# Altium schematic sheet Switch for MMU Schematic.schdoc
size 119 x 44 mm
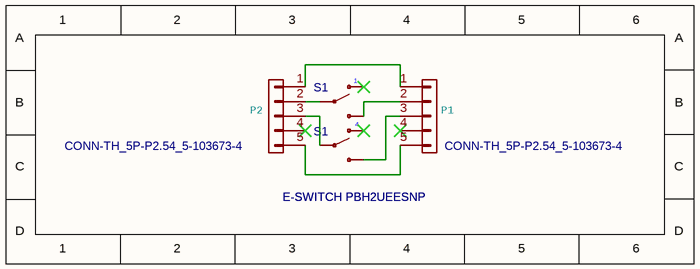
[diagram p0: Switch for MMU Schematic.schdoc]

## Parts
(Parts that share a designator on the sheet are numbered #1, #2 ... from top to bottom, then left to right.)
P1  MOLEX 70543-0004  [CONN-TH_5P-P2.54_5-103673-4]  (value not drawn)
P2  MOLEX 70543-0004  [CONN-TH_5P-P2.54_5-103673-4]  (value not drawn)
S1#1  SWITCH-SPSTPTH2  [E-SWITCH PBH2UEESNP]  (value not drawn)
S1#2  SWITCH-SPSTPTH2  [E-SWITCH PBH2UEESNP]  (value not drawn)

## Nets
NetP1_1: P1.1(P1) P2.1(P1)
NetP1_2: P1.2(P2) S1#1.1(S)
NetP1_3: P1.3(P3) S1#2.4(S)
NetP1_5: P1.5(P5) P2.5(P5)
NetP2_2: P2.2(P2) S1#1.2(P)
NetP2_3: P2.3(P3) S1#2.5(P)

Not connected (* = marked no-connect by the designer): P1 4(P4)*; P2 4(P4)*; S1#1 3(O)*; S1#2 6(O)*

## Notes on the sheet
- (in symbol MOLEX 70543-0004) CONN-TH_5P-P2.54_5-103673-4
- (in symbol SWITCH-SPSTPTH2) E-SWITCH PBH2UEESNP

## Library data of the parts
P1 P2 = MOLEX 70543-0004: Package Display: Yes
S1#1 S1#2 = SWITCH-SPSTPTH2: catid: 20; description: DPST Switch; Package Display: Yes; timeStamp: 1474662833; BOM_Manufacturer Part: ?; spicePre: S